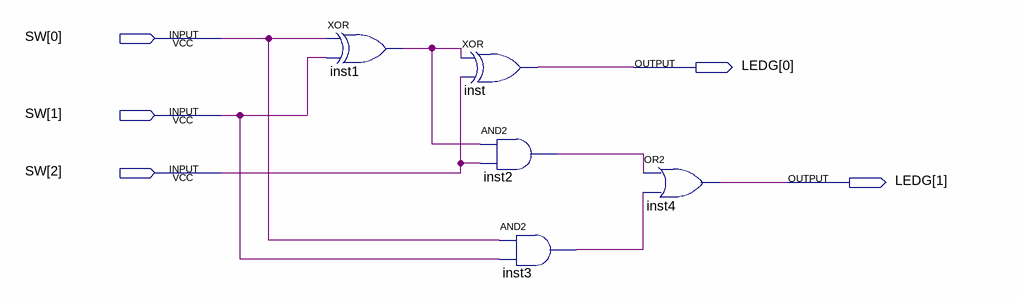
[diagram p0: schematic sheet]
// Quartus schematic fulladder.bdf as structural Verilog: 5 symbols, 5 pins
module fulladder (
  input  [2:0] SW,
  output [1:0] LEDG
);

  wire inst1_out, inst2_out, inst3_out;

  xor inst1 (inst1_out, SW[0], SW[1]);
  xor inst (LEDG[0], inst1_out, SW[2]);
  and inst2 (inst2_out, inst1_out, SW[2]);
  and inst3 (inst3_out, SW[0], SW[1]);
  or inst4 (LEDG[1], inst2_out, inst3_out);
endmodule
